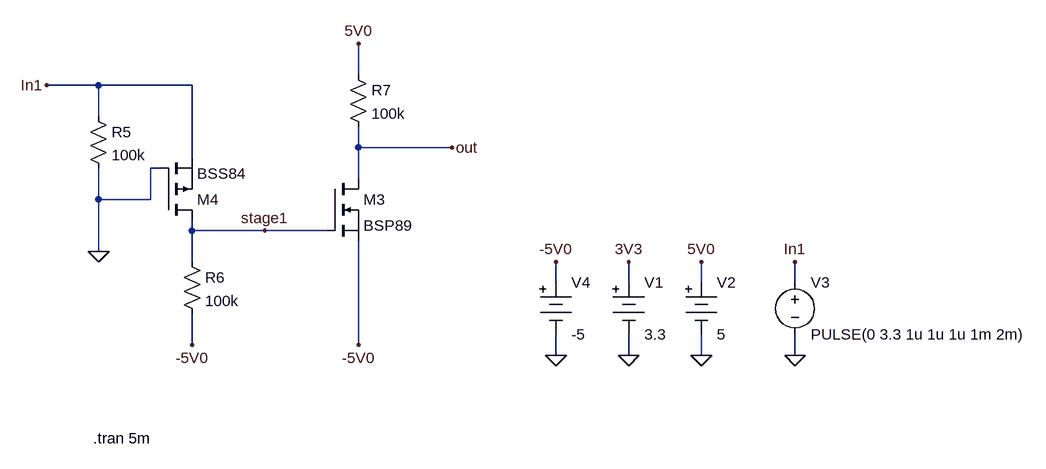
[diagram p0: schematic Level shifter for negative 5V.asc]
Level shifter for negative 5V.asc, the LTspice schematic file:
Version 4
SHEET 1 1688 1124
WIRE 640 -208 640 -256
WIRE 240 -192 160 -192
WIRE 384 -192 240 -192
WIRE 240 -144 240 -192
WIRE 640 -96 640 -128
WIRE 784 -96 640 -96
WIRE 384 -80 384 -192
WIRE 336 -64 320 -64
WIRE 640 -48 640 -96
WIRE 240 -16 240 -64
WIRE 320 -16 320 -64
WIRE 320 -16 240 -16
WIRE 384 32 384 16
WIRE 496 32 384 32
WIRE 592 32 496 32
WIRE 240 64 240 -16
WIRE 384 80 384 32
WIRE 944 112 944 80
WIRE 1056 112 1056 80
WIRE 1168 112 1168 80
WIRE 1312 112 1312 80
WIRE 384 208 384 160
WIRE 640 208 640 48
WIRE 944 224 944 192
WIRE 1056 224 1056 192
WIRE 1168 224 1168 192
WIRE 1312 224 1312 192
FLAG 1056 224 0
FLAG 1168 224 0
FLAG 1056 80 3V3
FLAG 1168 80 5V0
FLAG 1312 224 0
FLAG 1312 80 In1
FLAG 944 224 0
FLAG 944 80 -5V0
FLAG 240 64 0
FLAG 160 -192 In1
FLAG 384 208 -5V0
FLAG 640 208 -5V0
FLAG 640 -256 5V0
FLAG 784 -96 out
FLAG 496 32 stage1
SYMBOL Misc\\battery 1056 96 R0
WINDOW 123 0 0 Left 0
WINDOW 39 0 0 Left 0
SYMATTR InstName V1
SYMATTR Value 3.3
SYMBOL Misc\\battery 1168 96 R0
WINDOW 123 0 0 Left 0
WINDOW 39 0 0 Left 0
SYMATTR InstName V2
SYMATTR Value 5
SYMBOL voltage 1312 96 R0
WINDOW 123 0 0 Left 0
WINDOW 39 0 0 Left 0
SYMATTR InstName V3
SYMATTR Value PULSE(0 3.3 1u 1u 1u 1m 2m)
SYMBOL Misc\\battery 944 96 R0
WINDOW 123 0 0 Left 0
WINDOW 39 0 0 Left 0
SYMATTR InstName V4
SYMATTR Value -5
SYMBOL res 224 -160 R0
SYMATTR InstName R5
SYMATTR Value 100k
SYMBOL res 368 64 R0
SYMATTR InstName R6
SYMATTR Value 100k
SYMBOL res 624 -224 R0
SYMATTR InstName R7
SYMATTR Value 100k
SYMBOL nmos 592 -48 R0
SYMATTR InstName M3
SYMATTR Value BSP89
SYMBOL pmos 336 16 M180
SYMATTR InstName M4
SYMATTR Value BSS84
TEXT 232 352 Left 2 !.tran 5m

The netlist it stands for:
* Level shifter for negative 5V.asc
V1 3V3 0 3.3
V2 5V0 0 5
V3 In1 0 PULSE(0 3.3 1u 1u 1u 1m 2m)
V4 -5V0 0 -5
R5 In1 0 100k
R6 stage1 -5V0 100k
R7 5V0 out 100k
M3 out stage1 -5V0 -5V0 BSP89
M4 stage1 0 In1 In1 BSS84
.model NMOS NMOS
.model PMOS PMOS
.lib standard.mos
.tran 5m
.backanno
.end